# Altium schematic sheet TOP.SchDoc
size A4; Organization: Altium Limited; Address1: L3, 12a Rodborough Rd; Address2: Frenchs Forest; Address3: NSW; Address4: Australia 2086
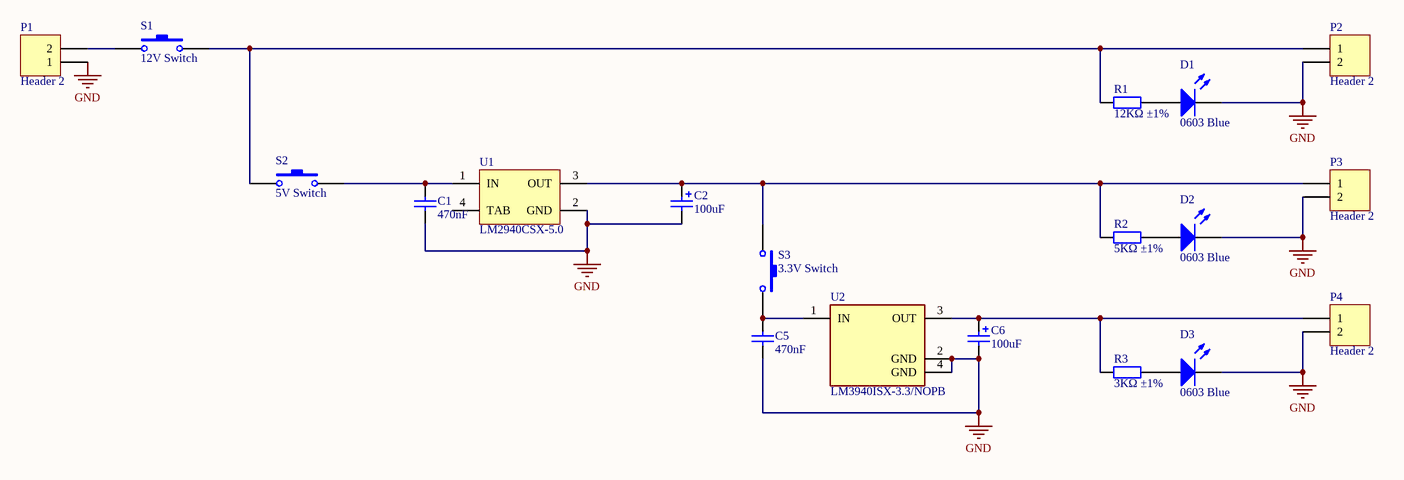
[diagram p0: TOP.SchDoc]

## Parts
C1  470nF  [1206_C]
C2  100uF  [CASE-B_3528]
C5  470nF  [0805_C]
C6  100uF  [CASE-B_3528]
D1  0603 Blue  [0603_LED_S1]
D2  0603 Blue  [0603_LED_S1]
D3  0603 Blue  [0603_LED_S1]
P1  Header 2  [HDR1X2]
P2  Header 2  [HDR1X2]
P3  Header 2  [HDR1X2]
P4  Header 2  [HDR1X2]
R1  12KΩ ±1%  [0805_R]
R2  5KΩ ±1%  [0805_R]
R3  3KΩ ±1%  [0805_R]
S1  12V Switch  [SPST-2]
S2  5V Switch  [SPST-2]
S3  3.3V Switch  [SPST-2]
U1  LM2940CSX-5.0  [KTT0003B_L]
U2  LM3940ISX-3.3/NOPB  [FP-KTT0003B-MFG]

## Nets
GND: C1.1 C2.2 C5.1 C6.2 D1.K D2.K D3.K P1.1 P2.2 P3.2 P4.2 U1.2(GND) U2.2(GND) U2.4(GND)
NetC1_2: C1.2 S2.2 U1.1(IN)
NetC2_1: C2.1 P3.1 R2.1 S3.1 U1.3(OUT)
NetC5_2: C5.2 S3.2 U2.1(IN)
NetC6_1: C6.1 P4.1 R3.1 U2.3(OUT)
NetD1_A: D1.A R1.2
NetD2_A: D2.A R2.2
NetD3_A: D3.A R3.2
NetP1_2: P1.2 S1.1
NetP2_1: P2.1 R1.1 S1.2 S2.1

Not connected (* = marked no-connect by the designer): U1 4(TAB)

## Notes on the sheet
- Title
- Size:
- Date:
- A4
- Number:
- Time:
- Revision:
- Sheet
- of
- File:

## Library data of the parts
C1 = 1206 470nF (474) 10% 50V: Chip capacitors; Manufacturer: Guangdong Fenghua Advanced Tech; PartNumber: 1206B474K500NT; Tolerance: 10%; Voltage: 50V; ComponentLink1Description: Supplier link; ComponentLink1URL: http://www.szlcsc.com/product/details_2223.html; Package: 1206; Supplier: LC; SuppliersPartNumber: C1871; Capacitance: 470nF
C2 C6 = 3528 100uF (107) 10% 6.3V: Tantalum capacitor; Manufacturer: AVX; PartNumber: TAJB107K006RNJ; Tolerance: 10%; Voltage: 6.3V; ComponentLink1Description: Supplier link; ComponentLink1URL: http://www.szlcsc.com/product/details_16815.html; Package: 3528; Supplier: LC; SuppliersPartNumber: C16133; Capacitance: 100uF
C5 = 0805 470nF (474) 10% 50V: Chip capacitors; Manufacturer: Samsung Electro-Mechanics; PartNumber: CL21B474KBFNNNE; Tolerance: 10%; Voltage: 50V; ComponentLink1Description: Supplier link; ComponentLink1URL: http://www.szlcsc.com/product/details_14623.html; Package: 0805; Supplier: LC; SuppliersPartNumber: C13967; Capacitance: 470nF
D1-D3 = 0603 LED Blue: LED; ComponentLink1Description: 供应商链接; ComponentLink1URL: http://www.szlcsc.com/product/details_73150.html; Package: 0603; Supplier: LC; SuppliersPartNumber: C72041; Color: Blue
P1-P4 = Header 2: Header, 2-Pin; LatestRevisionDate: 17-Jul-2002; LatestRevisionNote: Re-released for DXP Platform.; Publisher: Altium Limited
R1-R3 = 0805 1M (1004) 1%: Chip resistor; Manufacturer: Uniroyal Elec; Power: 1/8W; ComponentLink1Description: Supplier link; ComponentLink1URL: http://www.szlcsc.com/product/details_18202.html; Package: 0805; Supplier: LC; SuppliersPartNumber: C17514; Tolerance: 1%
S1-S3 = SW-PB: Switch; Published: 24-Mar-1999; LatestRevisionDate: 17-Jul-2002; LatestRevisionNote: Re-released for DXP Platform.; PackageReference: SPST-2; Publisher: Altium Limited; PackageDescription: Switch; 2 Leads
U1 = CMP-0062-00571-4: 1A Low Dropout Regulator, 3-pin TO-263; Manufacturer: Texas Instruments; PowerWise: N; CompType: LDO IC; PackageTopMarking: NSUZXYTTE#*LM2940CS*-5.0 P+; PinCount: 3; ComponentLink1URL: http://www.ti.com/general/docs/lit/getliterature.tsp?genericPartNumber=LM2940C&fileType=pdf; PackageDescription: TO-263, Molded, .400 x .390 x .180in, 3 Lead, .1in Pitch, Surface Mount; ComponentLink1Description: Datasheet URL; Code_JEDEC: MO-169-AA; RoHS: N; PackageReference: KTT0003B
U2 = CMP-04917-000003-1: IC REG LIN 3.3V 1A DDPAK/TO263-3; Manufacturer: Texas Instruments; Accuracy Percentage: 2.5%; Min Supply Voltage: 4.5V; Max Junction Temp: +125°C; Dropout Voltage: 0.5V; Number Of Outputs: 1; Output Type: Fixed; Max Supply Voltage: 5.5V; Standoff Height: 0mm; Nominal Supply Current: 10-110mA; Device Class L3: Voltage Regulators - Linear; Octopart: https://octopart.com/lm3940isx-3.3%2Fnopb-texas+instruments-24814218; Digikey Description: IC REG LIN 3.3V 1A DDPAK/TO263-3; Manufacturer Part Number: LM3940ISX-3.3/NOPB; ComponentLink2URL: http://www.ti.com/lit/ds/symlink/lm3940.pdf; Automotive: No; Category: IC; Device Class L2: Power Management ICs; Package: KTT0003B; Device Class L1: Integrated Circuits (ICs); Output Current: 1A; Output Voltage: 3.3V; Mouser Description: LDO Voltage Regulators 1A LDO REG; Height: 4.79mm; Lead Free: Yes; Temperature Range High: +125°C; Temperature Range Low: -40°C; Temperature: -40°C to +125°C; RoHS: TRUE; ComponentLink2Description: Datasheet